# Altium schematic sheet POWER.SchDoc: LED Cube 8x8x8 - POWER
size A4; Author: Luka Penger; CompanyName: L. Penger; DrawnBy: Luka Penger; Organization: L. Penger; Address1: Luka Penger; Address2: http://lukapenger.eu; Address3: Software & Hardware; Address4: Development; DocumentNumber: 3; Revision: 4.1.0; SheetNumber: 3; SheetTotal: 3; DocumentName: POWER; ProjectName: LED Cube 8x8x8
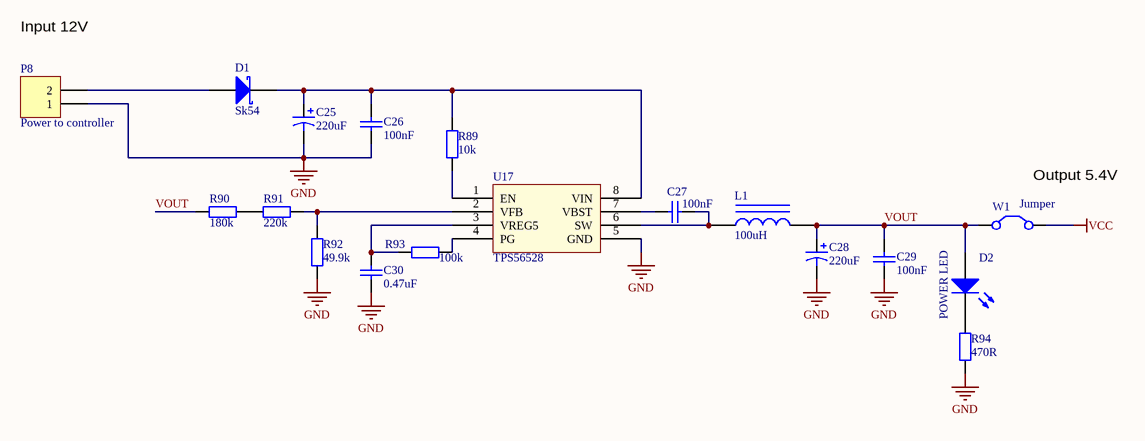
[diagram p0: POWER.SchDoc]

## Parts
C25  220uF  [SMD CAPACITOR 220uF]
C26  100nF  [1608[0603]]
C27  100nF  [1608[0603]]
C28  220uF  [SMD CAPACITOR 220uF]
C29  100nF  [1608[0603]]
C30  0.47uF  [1608[0603]]
D1  Sk54  [DIODE SMC 6x7mm]
D2  POWER LED  [LED-1]
L1  100uH  [SMD Inductor 12x12mm]
P8  Power to controller  [Block2 - 3.81]
R89  10k  [1608[0603]]
R90  180k  [6-0805_L]
R91  220k  [6-0805_L]
R92  49.9k  [1608[0603]]
R93  100k  [1608[0603]]
R94  470R  [1608[0603]]
U17  TPS56528  [TPS56528]
W1  Jumper  [HDR1X2]

## Nets
GND: C25.2 C26.2 C28.2 C29.2 C30.2 P8.1 R92.1 R94.1 U17.5(GND)
VCC: W1.2(C2)
VOUT: C28.1 C29.1 D2.1(A) L1.2 R90.2 W1.1(C1)
NetC25_1: C25.1 C26.1 D1.2(K) R89.2 U17.8(VIN)
NetC27_1: C27.1 U17.7(VBST)
NetC27_2: C27.2 L1.1 U17.6(SW)
NetC30_1: C30.1 R93.2 U17.3(VREG5)
NetD1_1: D1.1(A) P8.2
NetD2_2: D2.2(K) R94.2
NetR89_1: R89.1 U17.1(EN)
NetR90_1: R90.1 R91.2
NetR91_1: R91.1 R92.2 U17.2(VFB)
NetR93_1: R93.1 U17.4(PG)

## Notes on the sheet
- Input 12V
- (near W1) Output 5.4V
- Title
- Size:
- Date:
- A4
- Number:
- Time:
- Revision:
- Sheet
- of
- File:

## Library data of the parts
C25 C28 = Cap Pol1: Capacitor; Value: 100pF; Published: 8-Jun-2000; LatestRevisionDate: 17-Jul-2002; LatestRevisionNote: Re-released for DXP Platform.; PackageReference: RB7.6-15; Publisher: Altium Limited; PackageDescription: Polarized Capacitor (Radial); 2 Leads
C26 C27 C29 C30 = Cap: Capacitor; Value: 100pF; Published: 8-Jun-2000; LatestRevisionDate: 17-Jul-2002; LatestRevisionNote: Re-released for DXP Platform.; PackageReference: RAD-0.3; Publisher: Altium Limited; PackageDescription: Radial Cap, Thru-Hole; 2 Leads; 0.3 in Pin Spacing
D1 = D Schottky: Schottky Diode; Published: 8-Jun-2000; LatestRevisionDate: 17-Jul-2002; LatestRevisionNote: Re-released for DXP Platform.; PackageReference: SMB; Publisher: Altium Limited; PackageDescription: DO-214-AA/SMB; 2 C-Bend Leads; Body 5.3 x 3.6 mm, inc. leads (LxW); Code_JEDEC: DO-214-AA
D2 = LED0: Typical INFRARED GaAs LED; Published: 8-Jun-2000; LatestRevisionDate: 08-Jul-2005; LatestRevisionNote: Mech Layer 1 removed.; PackageReference: LED-0; Publisher: Altium Limited; PackageDescription: LED; 2 Leads
L1 = Inductor Iron: Magnetic-Core Inductor; Value: 10mH; Published: 24-Mar-1999; LatestRevisionDate: 17-Jul-2002; LatestRevisionNote: Re-released for DXP Platform.; PackageReference: AXIAL-0.9; Publisher: Altium Limited; PackageDescription: Axial Device, Thru-Hole; 2 Leads; 0.9 in Pin Spacing
P8 = Header 2: Header, 2-Pin; LatestRevisionDate: 17-Jul-2002; LatestRevisionNote: Re-released for DXP Platform.; Publisher: Altium Limited
R89-R94 = Res2: Resistor; Value: 1K; Published: 8-Jun-2000; LatestRevisionDate: 17-Jul-2002; LatestRevisionNote: Re-released for DXP Platform.; PackageReference: AXIAL-0.4; Publisher: Altium Limited; PackageDescription: Axial Device, Thru-Hole; 2 Leads; 0.4 in Pin Spacing
U17 = TPS56528: Step-Down Converter 5A 4.5V-18V
W1 = Jumper: Jumper Wire; Published: 24-Mar-1999; LatestRevisionDate: 17-Jul-2002; LatestRevisionNote: Re-released for DXP Platform.; PackageReference: RAD-0.2; Publisher: Altium Limited; PackageDescription: Radial Cap, Thru-Hole; 2 Leads; 0.2 in Pin Spacing